# Altium schematic sheet OSP_Carrier_V7_Release_Misc.SchDoc: OSP Full Carrier Board
size B; DrawnBy: LP; Revision: 1; SheetNumber: 6; SheetTotal: 7
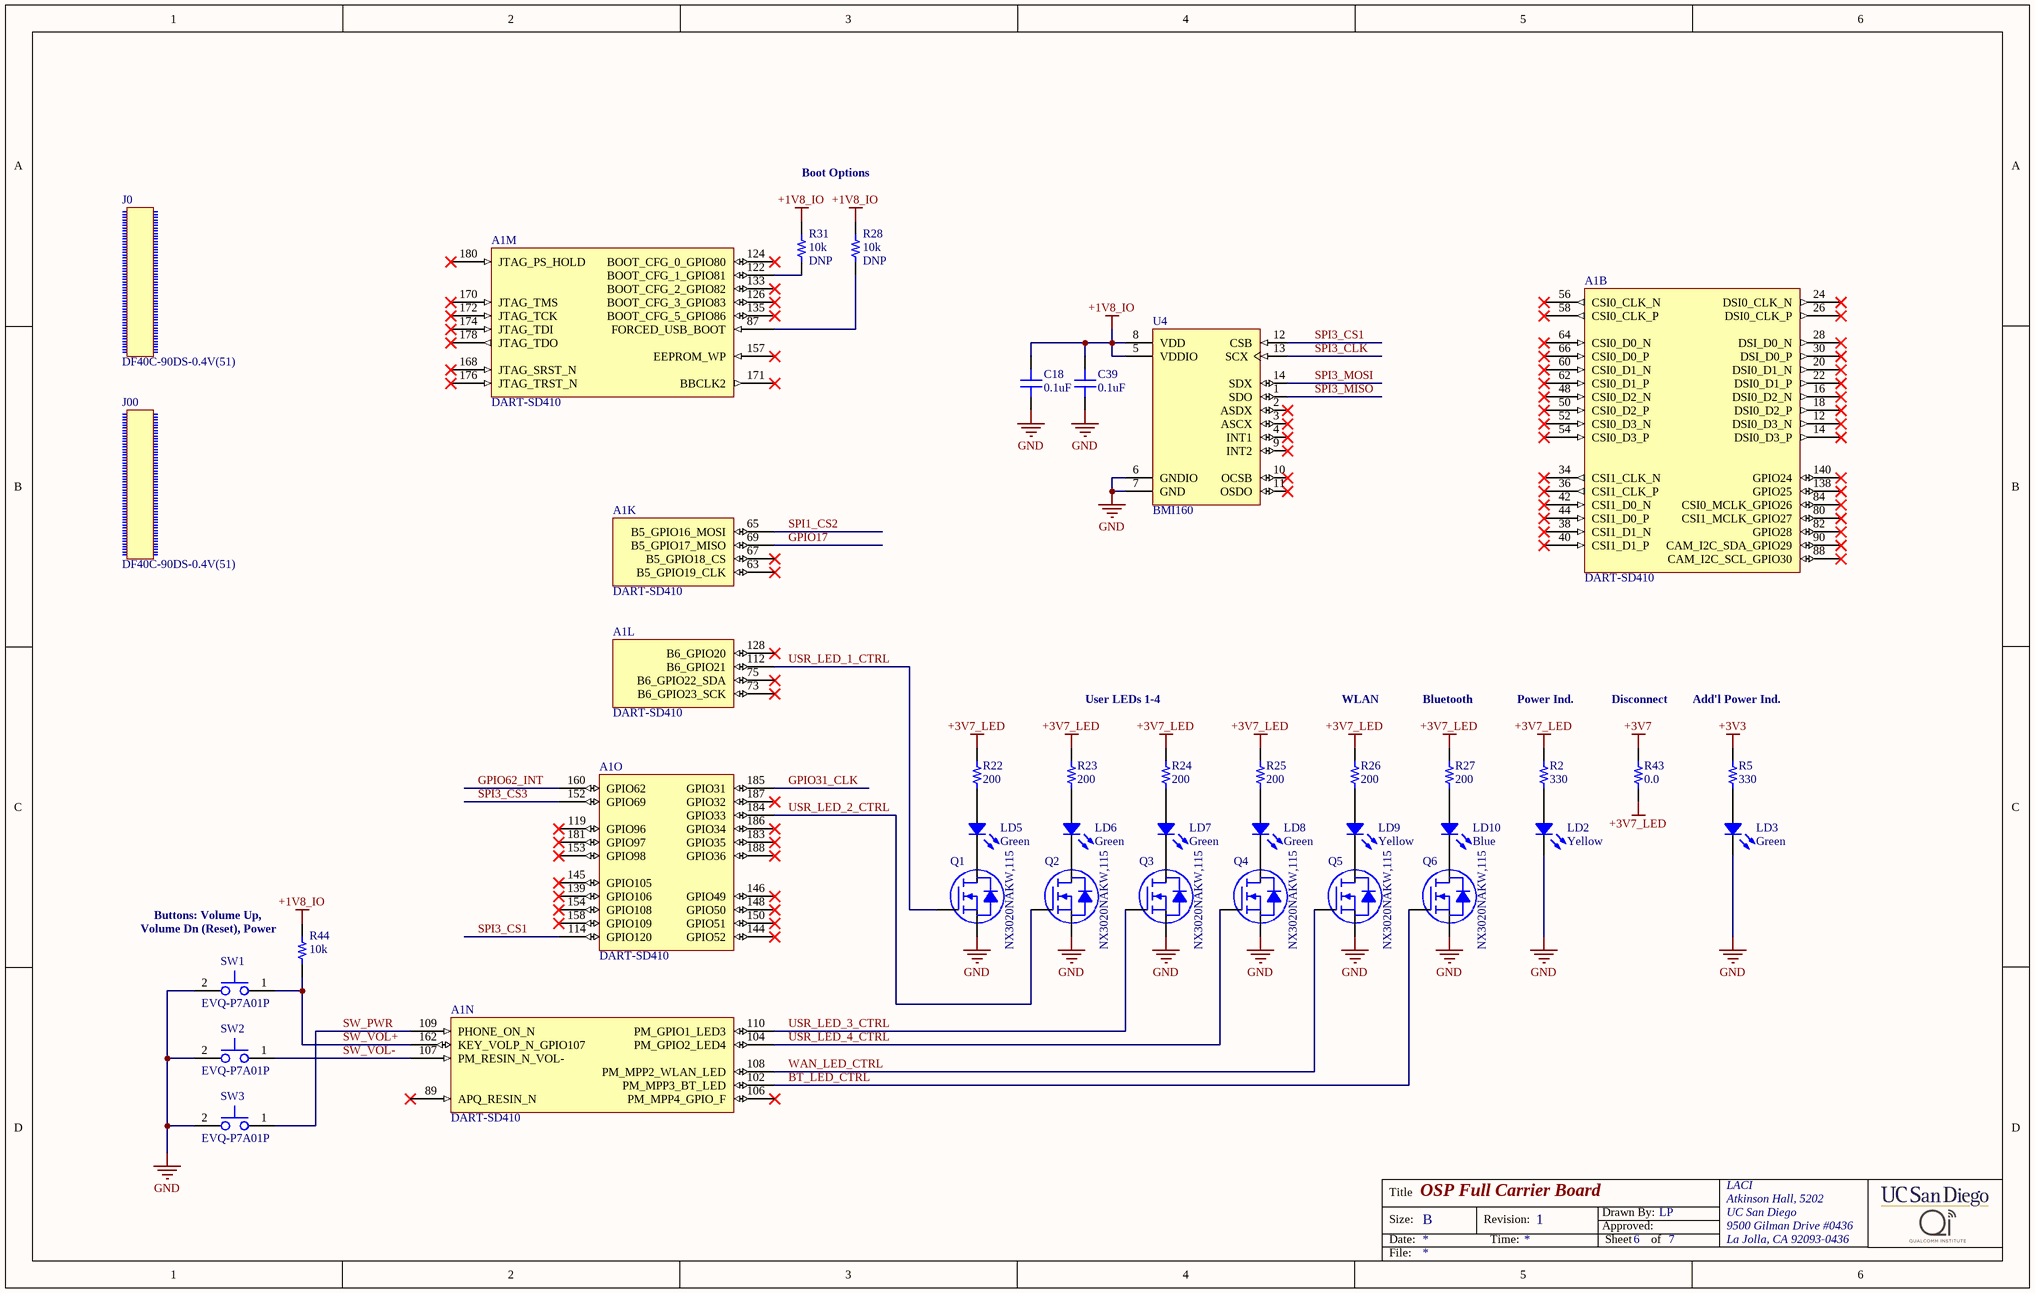
[diagram p0: OSP_Carrier_V7_Release_Misc.SchDoc]

## Parts
A1  DART-SD410  [DART-SD410]  (parts B,K,L,M,N,O of 15)
C18  0.1uF  [CAP 0402/1005]
C39  0.1uF  [CAP 0402/1005]
J0  DF40C-90DS-0.4V(51)  [Hirose_DF40C-90DS-0.4V(51)]
J00  DF40C-90DS-0.4V(51)  [Hirose_DF40C-90DS-0.4V(51)]
LD2  Yellow  [LED 0603/1608 YELLOW]
LD3  Green  [LED 0603/1608 GREEN]
LD5  Green  [LED 0603/1608 GREEN]
LD6  Green  [LED 0603/1608 GREEN]
LD7  Green  [LED 0603/1608 GREEN]
LD8  Green  [LED 0603/1608 GREEN]
LD9  Yellow  [LED 0603/1608 YELLOW]
LD10  Blue  [LED 0603/1608 BLUE]
Q1  NX3020NAKW,115  [NXP SOT-323-3]
Q2  NX3020NAKW,115  [NXP SOT-323-3]
Q3  NX3020NAKW,115  [NXP SOT-323-3]
Q4  NX3020NAKW,115  [NXP SOT-323-3]
Q5  NX3020NAKW,115  [NXP SOT-323-3]
Q6  NX3020NAKW,115  [NXP SOT-323-3]
R2  330  [RES 0402/1005]
R5  330  [RES 0402/1005]
R22  200  [RES 0402/1005]
R23  200  [RES 0402/1005]
R24  200  [RES 0402/1005]
R25  200  [RES 0402/1005]
R26  200  [RES 0402/1005]
R27  200  [RES 0402/1005]
R28  10k  [RES 0402/1005]
R31  10k  [RES 0402/1005]
R43  0.0  [RES 0603/1608]
R44  10k  [RES 0402/1005]
SW1  EVQ-P7A01P  [PANASONIC_EVQ-P7A]
SW2  EVQ-P7A01P  [PANASONIC_EVQ-P7A]
SW3  EVQ-P7A01P  [PANASONIC_EVQ-P7A]
U4  BMI160  [BOSCH_LGA14]

## Nets
+1V8_IO: C18.1 C39.1 R28.2 R31.2 R44.2 U4.5(VDDIO) U4.8(VDD)
+3V3: R5.1
+3V7: R43.2
+3V7_LED: R2.1 R22.2 R23.2 R24.2 R25.2 R26.2 R27.2 R43.1
GND: C18.2 C39.2 LD2.2 LD3.2 Q1.3(S) Q2.3(S) Q3.3(S) Q4.3(S) Q5.3(S) Q6.3(S) SW1.2 SW2.2 SW3.2 U4.6(GNDIO) U4.7(GND)
BT_LED_CTRL: A1.102(PM_MPP3_BT_LED) Q6.1(G)
GPIO17: A1.69(B5_GPIO17_MISO)
GPIO31_CLK: A1.185(GPIO31)
GPIO62_INT: A1.160(GPIO62)
SPI1_CS2: A1.65(B5_GPIO16_MOSI)
SPI3_CLK: U4.13(SCX)
SPI3_CS1: A1.114(GPIO120) U4.12(CSB)
SPI3_CS3: A1.152(GPIO69)
SPI3_MISO: U4.1(SDO)
SPI3_MOSI: U4.14(SDX)
SW_PWR: A1.109(PHONE_ON_N) SW3.1
SW_VOL+: A1.162(KEY_VOLP_N_GPIO107) R44.1 SW1.1
SW_VOL-: A1.107(PM_RESIN_N_VOL-) SW2.1
USR_LED_1_CTRL: A1.112(B6_GPIO21) Q1.1(G)
USR_LED_2_CTRL: A1.184(GPIO33) Q2.1(G)
USR_LED_3_CTRL: A1.110(PM_GPIO1_LED3) Q3.1(G)
USR_LED_4_CTRL: A1.104(PM_GPIO2_LED4) Q4.1(G)
WAN_LED_CTRL: A1.108(PM_MPP2_WLAN_LED) Q5.1(G)
NetA1_87: A1.87(FORCED_USB_BOOT) R28.1
NetA1_122: A1.122(BOOT_CFG_1_GPIO81) R31.1
NetLD2_1: LD2.1 R2.2
NetLD3_1: LD3.1 R5.2
NetLD5_1: LD5.1 R22.1
NetLD5_2: LD5.2 Q1.2(D)
NetLD6_1: LD6.1 R23.1
NetLD6_2: LD6.2 Q2.2(D)
NetLD7_1: LD7.1 R24.1
NetLD7_2: LD7.2 Q3.2(D)
NetLD8_1: LD8.1 R25.1
NetLD8_2: LD8.2 Q4.2(D)
NetLD9_1: LD9.1 R26.1
NetLD9_2: LD9.2 Q5.2(D)
NetLD10_1: LD10.1 R27.1
NetLD10_2: LD10.2 Q6.2(D)

Not connected (* = marked no-connect by the designer): A1 12(DSI0_D3_N)* 14(DSI0_D3_P)* 16(DSI0_D2_N)* 18(DSI0_D2_P)* 20(DSI0_D1_N)* 22(DSI0_D1_P)* 24(DSI0_CLK_N)* 26(DSI0_CLK_P)* 28(DSI_D0_N)* 30(DSI_D0_P)* 34(CSI1_CLK_N)* 36(CSI1_CLK_P)* 38(CSI1_D1_N)* 40(CSI1_D1_P)* 42(CSI1_D0_N)* 44(CSI1_D0_P)* 48(CSI0_D2_N)* 50(CSI0_D2_P)* 52(CSI0_D3_N)* 54(CSI0_D3_P)* 56(CSI0_CLK_N)* 58(CSI0_CLK_P)* 60(CSI0_D1_N)* 62(CSI0_D1_P)* 63(B5_GPIO19_CLK)* 64(CSI0_D0_N)* 66(CSI0_D0_P)* 67(B5_GPIO18_CS)* 73(B6_GPIO23_SCK)* 75(B6_GPIO22_SDA)* 80(CSI1_MCLK_GPIO27)* 82(GPIO28)* 84(CSI0_MCLK_GPIO26)* 88(CAM_I2C_SCL_GPIO30)* 89(APQ_RESIN_N)* 90(CAM_I2C_SDA_GPIO29)* 106(PM_MPP4_GPIO_F)* 119(GPIO96)* 124(BOOT_CFG_0_GPIO80)* 126(BOOT_CFG_3_GPIO83)* 128(B6_GPIO20)* 133(BOOT_CFG_2_GPIO82)* 135(BOOT_CFG_5_GPIO86)* 138(GPIO25)* 139(GPIO106)* 140(GPIO24)* 144(GPIO52)* 145(GPIO105)* 146(GPIO49)* 148(GPIO50)* 150(GPIO51)* 153(GPIO98)* 154(GPIO108)* 157(EEPROM_WP)* 158(GPIO109)* 168(JTAG_SRST_N)* 170(JTAG_TMS)* 171(BBCLK2)* 172(JTAG_TCK)* 174(JTAG_TDI)* 176(JTAG_TRST_N)* 178(JTAG_TDO)* 180(JTAG_PS_HOLD)* 181(GPIO97)* 183(GPIO35)* 186(GPIO34)* 187(GPIO32)* 188(GPIO36)*; U4 2(ASDX)* 3(ASCX)* 4(INT1)* 9(INT2)* 10(OCSB)* 11(OSDO)*

## Notes on the sheet
- Boot Options
- User LEDs 1-4
- WLAN
- Bluetooth
- Power Ind.
- Disconnect
- Add'l Power Ind.
- (near R44) Volume Dn (Reset), Power
- (near R44) Buttons: Volume Up,
- Title
- Size:
- Date:
- B
- Revision:
- Time:
- Drawn By:
- Approved:
- Sheet
- of
- LACI
- Atkinson Hall, 5202
- UC San Diego
- 9500 Gilman Drive #0436
- La Jolla, CA 92093-0436
- File:

## Library data of the parts
A1 = DART-SD410: Variscite DART-SD410 System on Module
C18 C39 = C1005X7R1H104K050BB: CAP CER 0.1UF 50V X7R 0402; Manufacturer: TDK Corporation; TemperatureRange: -55C ~ 125C; Tolerance: 10%; Value: 0.1uF; Part Number: C1005X7R1H104K050BB; PartId: 3860; Supplier 1: Digi-Key; Supplier Part Number 1: 445-5932-2-ND; ComponentLink1Description: Datasheet; ComponentLink1URL: https://product.tdk.com/info/en/catalog/datasheets/mlcc_commercial_general_en.pdf; ComponentLink2Description: Digi-Key listing; ComponentLink2URL: http://digikey.com/product-detail/en/C1005X7R1H104K050BB/445-5932-2-ND/2443410; TemperatureCoefficient: X7R; Voltage: 50V; Price: 0.0287; Type: -; Device Package: 0402 (1005 Metric)
J0 J00 = Dummy_Hirose_SoM_Connector: Hirose DF40C-90DS-0.4V(51) Board-to-Board Connector
LD2 LD9 = LTST-C191KSKT: LED YELLOW CLEAR 0603 SMD; Manufacturer: Lite-On Inc.; Value: Green; Type: Surface Mount; Millicandela: 104mcd; Voltage Forward: 2.1V; Current (Test): 20mA; Viewing Angle: 130; Part Number: LTST-C191KSKT; PartId: 7053; Supplier 1: Digi-Key; Supplier Part Number 1: 160-1448-2-ND; ComponentLink1Description: Datasheet; ComponentLink1URL: http://optoelectronics.liteon.com/upload/download/DS22-2000-224/S_110_LTST-C191KSKT.pdf; ComponentLink2Description: Digi-Key Listing; ComponentLink2URL: http://www.digikey.ca/product-detail/en/LTST-C191KSKT/160-1448-2-ND/386839; Price: 0.0555; Device Package: 0603 (1608 Metric); Colour: Yellow; Lens Transparency: Clear
LD3 LD5-LD8 = LTST-C191KGKT: LED GREEN CLEAR 0603 SMD; Manufacturer: Lite-On Inc.; Type: Surface Mount; Millicandela: 35mcd; Voltage Forward: 2V; Current (Test): 20mA; Viewing Angle: 130; Value: Green; Part Number: LTST-C191KGKT; PartId: 7051; Supplier 1: Digi-Key; Supplier Part Number 1: 160-1446-2-ND; ComponentLink1Description: Datasheet; ComponentLink1URL: http://optoelectronics.liteon.com/upload/download/DS22-2000-228/S_110_LTST-C191KGKT.pdf; ComponentLink2Description: Digi-Key Listing; ComponentLink2URL: http://www.digikey.ca/product-detail/en/LTST-C191KGKT/160-1446-2-ND/386835; Price: 0.0521; Device Package: 0603 (1608 Metric); Colour: Green; Lens Transparency: Clear
LD10 = LTST-C193TBKT-5A: LED BLUE CLEAR 0603 SMD; Manufacturer: Lite-On Inc.; Value: Green; Type: Surface Mount; Millicandela: 15mcd; Voltage Forward: 2.8V; Current (Test): 5mA; Viewing Angle: 130; Part Number: LTST-C193TBKT-5A; PartId: 7054; Supplier 1: Digi-Key; Supplier Part Number 1: 160-1827-2-ND; ComponentLink1Description: Datasheet; ComponentLink1URL: http://optoelectronics.liteon.com/upload/download/DS22-2004-060/P_100_LTST-C193TBKT-5A.pdf; ComponentLink2Description: Digi-Key Listing; ComponentLink2URL: http://www.digikey.ca/product-detail/en/LTST-C193TBKT-5A/160-1827-2-ND/2053656; Price: 0.0875; Device Package: 0603 (1608 Metric); Colour: Blue; Lens Transparency: Clear
Q1-Q6 = NX3020NAKW,115: MOSFET N-CH 30V 180MA SOT323; Part Number: NX3020NAKW,115
R2 R5 = ERJ-2RKF3300X: RES SMD 330 OHM 1% 1/10W 0402; Manufacturer: Panasonic Electronic Components; TemperatureRange: -55C ~ 155C; TemperatureCoefficient: 100ppm/C; PowerRating: 0.1W, 1/10W; Value: 330; Part Number: ERJ-2RKF3300X; PartId: 165; Supplier 1: Digi-Key; Supplier Part Number 1: P330LTR-ND; ComponentLink1Description: Datasheet; ComponentLink1URL: http://industrial.panasonic.com/www-cgi/jvcr13pz.cgi?E+PZ+3+AOA0002+ERJ2RKF3300X+7+WW; ComponentLink2Description: Digikey listing; ComponentLink2URL: http://digikey.com/product-detail/en/ERJ-2RKF3300X/P330LTR-ND/1746189; Tolerance: 1%; Price: 0.0043; Type: Thick Film; Device Package: 0402 (1005 Metric)
R22-R27 = ERJ-2RKF2000X: RES SMD 200 OHM 1% 1/10W 0402; Manufacturer: Panasonic Electronic Components; TemperatureRange: -55C ~ 155C; TemperatureCoefficient: 100ppm/C; PowerRating: 0.1W, 1/10W; Value: 200; Part Number: ERJ-2RKF2000X; PartId: 12; Supplier 1: Digi-Key; Supplier Part Number 1: P200LTR-ND; ComponentLink1Description: Datasheet; ComponentLink1URL: http://industrial.panasonic.com/www-cgi/jvcr13pz.cgi?E+PZ+3+AOA0002+ERJ2RKF2000X+7+WW; ComponentLink2Description: Digikey listing; ComponentLink2URL: http://digikey.com/product-detail/en/ERJ-2RKF2000X/P200LTR-ND/192215; Tolerance: 1%; Price: 0.0043; Type: Thick Film; Device Package: 0402 (1005 Metric)
R28 R31 R44 = ERJ-2RKF1002X: RES SMD 10K OHM 1% 1/10W 0402; Manufacturer: Panasonic Electronic Components; TemperatureRange: -55C ~ 155C; TemperatureCoefficient: 100ppm/C; PowerRating: 0.1W, 1/10W; Value: 10k; Part Number: ERJ-2RKF1002X; PartId: 1; Supplier 1: Digi-Key; Supplier Part Number 1: P10.0KLTR-ND; ComponentLink1Description: Datasheet; ComponentLink1URL: http://industrial.panasonic.com/www-cgi/jvcr13pz.cgi?E+PZ+3+AOA0002+ERJ2RKF1002X+7+WW; ComponentLink2Description: Digikey listing; ComponentLink2URL: http://digikey.com/product-detail/en/ERJ-2RKF1002X/P10.0KLTR-ND/192073; Tolerance: 1%; Price: 0.0043; Type: Thick Film; Device Package: 0402 (1005 Metric)
  R28 R31: DNP: DNP
R43 = CRCW06030000Z0EAHP: RES SMD 0.0 OHM JUMPER 1/4W 0603; Manufacturer: Vishay Dale; TemperatureRange: -55C ~ 155C; PowerRating: 0.25W, 1/4W; Value: 0.0; Part Number: CRCW06030000Z0EAHP; PartId: 16113; Supplier 1: Digi-Key; Supplier Part Number 1: 541-0.0SBTR-ND; ComponentLink1Description: Datasheet; ComponentLink1URL: http://www.vishay.com/docs/20043/crcwhpe3.pdf; ComponentLink2Description: Digi-Key Listing; ComponentLink2URL: https://www.digikey.com/product-detail/en/vishay-dale/CRCW06030000Z0EAHP/541-0.0SBTR-ND/2222231; Tolerance: Jumper; Price: 0.0238; Device Package: 0603 (1608 Metric)
SW1-SW3 = PANASONIC_EVQ-P7A01P: Tact Switch SMT Right Angle
U4 = BOSCH_BMI160: BMI160 2.5 x 3 mm Tiaxial Accelerometer / Gyroscope Inertial Measurement Unit